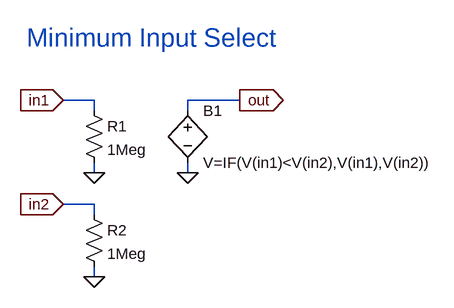
[diagram p0: schematic MIN.asc]
MIN.asc, the LTspice schematic file:
Version 4
SHEET 1 880 680
WIRE 112 64 64 64
WIRE 336 64 256 64
WIRE 112 80 112 64
WIRE 256 80 256 64
WIRE 112 176 112 160
WIRE 256 176 256 160
WIRE 112 224 64 224
WIRE 112 240 112 224
WIRE 112 336 112 320
FLAG 64 64 in1
IOPIN 64 64 In
FLAG 64 224 in2
IOPIN 64 224 In
FLAG 256 176 0
FLAG 336 64 out
IOPIN 336 64 Out
FLAG 112 176 0
FLAG 112 336 0
SYMBOL bv 256 64 R0
SYMATTR InstName B1
SYMATTR Value V=IF(V(in1)<V(in2),V(in1),V(in2))
SYMBOL res 96 64 R0
SYMATTR InstName R1
SYMATTR Value 1Meg
SYMBOL res 96 224 R0
SYMATTR InstName R2
SYMATTR Value 1Meg
TEXT 8 -32 Left 4 ;Minimum Input Select

The netlist it stands for:
* MIN.asc
B1 out 0 V=IF(V(in1)<V(in2),V(in1),V(in2))
R1 in1 0 1Meg
R2 in2 0 1Meg
* Minimum Input Select
.backanno
.end